# EAGLE design SY88022Al_breakout (EAGLE 9.2.2)
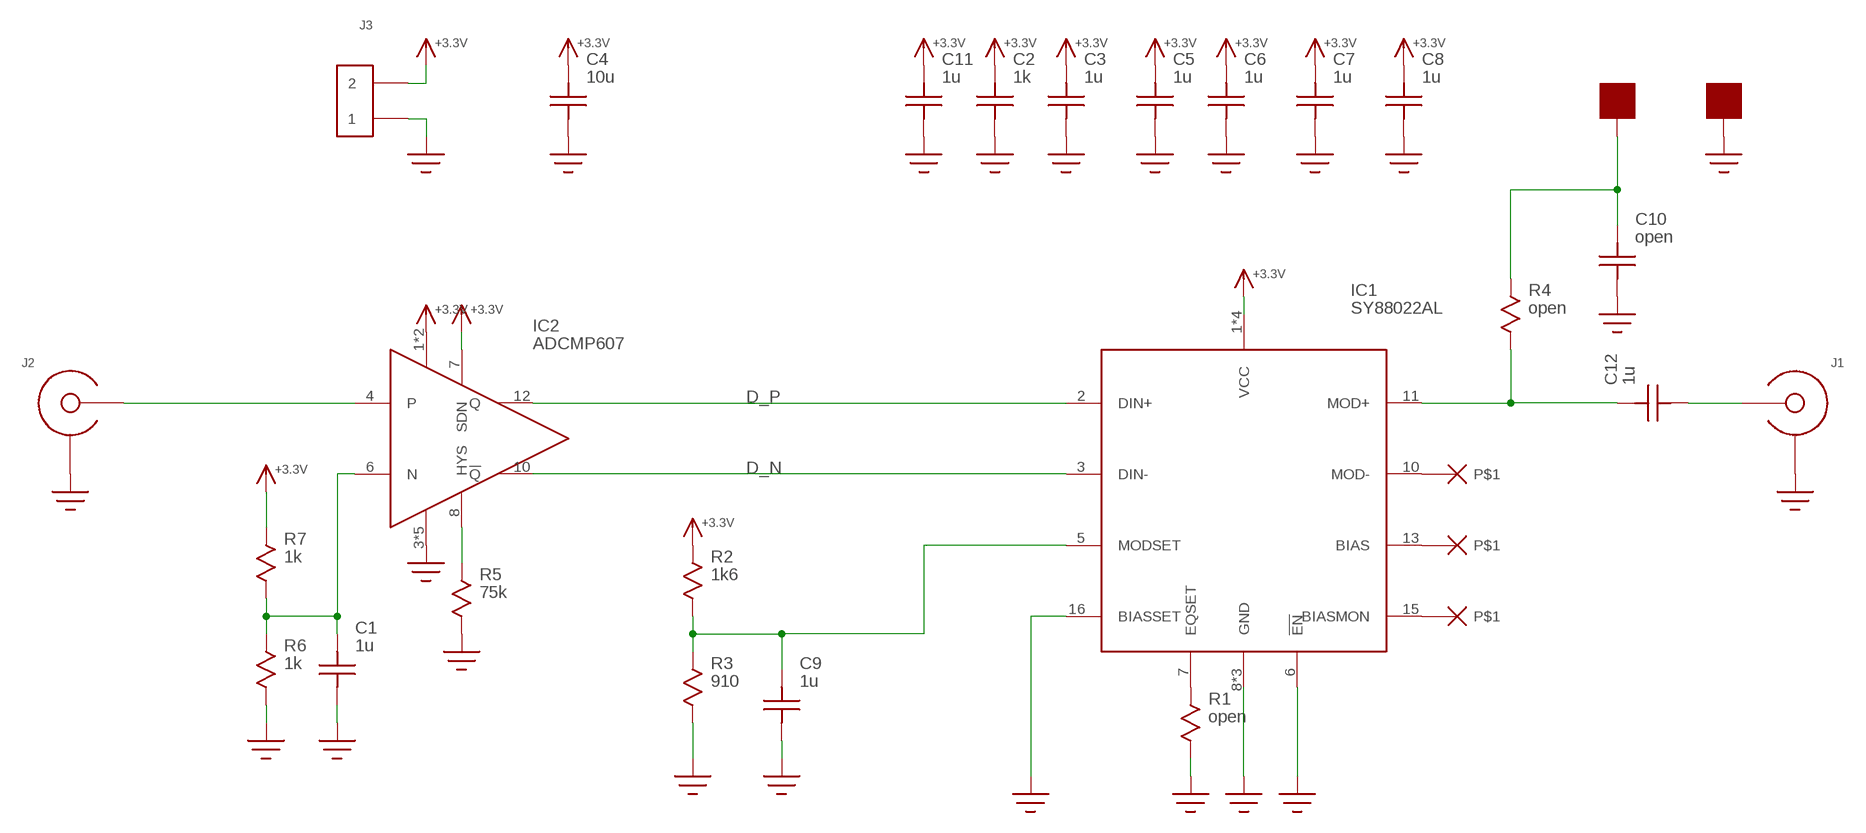
[diagram p0: schematic, sheet 1]

## Parts
C1  1u  C0603  [C0603]
C2  1k  C0603  [C0603]
C3  1u  C0603  [C0603]
C4  10u  C1206  [1206]
C5  1u  C0603  [C0603]
C6  1u  C0603  [C0603]
C7  1u  C0603  [C0603]
C8  1u  C0603  [C0603]
C9  1u  C0603  [C0603]
C10  open  C0603  [C0603]
C11  1u  C0603  [C0603]
C12  1u  C0603  [C0603]
IC1  SY88022AL  [TQFN16-EP]
IC2  ADCMP607  [QFN12-3X3]
J1  EDGE_LAUNCH_JACKNARROW  [EDGE_LAUNCH_RF_CON_NARROW]
J2  EDGE_LAUNCH_JACKNARROW  [EDGE_LAUNCH_RF_CON_NARROW]
J3  HEADER_2PIN  [HEADER_2PIN]
R1  open  R0402  [0402]
R2  1k6  R0603  [R0603]
R3  910  R0603  [R0603]
R4  open  R0603  [R0603]
R5  75k  R0603  [R0603]
R6  1k  R0603  [R0603]
R7  1k  R0603  [R0603]
U$25  NO_CONNECT  (no package)
U$26  NO_CONNECT  (no package)
U$29  PAD100MIL  [PAD_100MIL]
U$36  PAD100MIL  [PAD_100MIL]
U$42  NO_CONNECT  (no package)

## Nets
+3.3V: C2.P$2 C3.P$2 C4.P$2 C5.P$2 C6.P$2 C7.P$2 C8.P$2 C11.P$2 IC1.1(VCC) IC1.4(VCC) IC1.9(VCC) IC1.12(VCC) IC2.1(VCC) IC2.2(VCC) IC2.7(SDN) J3.2 R2.P$1 R7.P$1
D_N [100-ohm-diff]: IC1.3(DIN-) IC2.10(!Q!)
D_P [100-ohm-diff]: IC1.2(DIN+) IC2.12(Q)
GND: C1.P$1 C2.P$1 C3.P$1 C4.P$1 C5.P$1 C6.P$1 C7.P$1 C8.P$1 C9.P$1 C10.P$1 C11.P$1 IC1.6(!EN!) IC1.8(GND) IC1.14(GND) IC1.16(BIASSET) IC1.EP(GND) IC2.3(VEE) IC2.5(VEE) IC2.9(VEE) IC2.11(VEE) IC2.EP(VEE) J1.GND@1(SHIELD) J1.GND@2(SHIELD) J1.GND@3(SHIELD) J1.GND@4(SHIELD) J1.GND@5(SHIELD) J1.GND@6(SHIELD) J1.SHIELD@1(SHIELD) J1.SHIELD@2(SHIELD) J2.GND@1(SHIELD) J2.GND@2(SHIELD) J2.GND@3(SHIELD) J2.GND@4(SHIELD) J2.GND@5(SHIELD) J2.GND@6(SHIELD) J2.SHIELD@1(SHIELD) J2.SHIELD@2(SHIELD) J3.1 R1.2 R3.P$2 R5.P$2 R6.P$2 U$36.P$1
N$1: IC1.7(EQSET) R1.1
N$2: C9.P$2 IC1.5(MODSET) R2.P$2 R3.P$1
N$3: C12.P$1 J1.CENTER
N$4: IC1.13(BIAS) U$25.P$1
N$5: IC1.15(BIASMON) U$26.P$1
N$6: C12.P$2 IC1.11(MOD+) R4.P$2
N$7: C10.P$2 R4.P$1 U$29.P$1
N$8: IC1.10(MOD-) U$42.P$1
N$9: IC2.8(HYS) R5.P$1
N$10: C1.P$2 IC2.6(N) R6.P$1 R7.P$2
N$12: IC2.4(P) J2.CENTER

## Library data of the parts
C1-C12 = yapo:C
IC1 = yapo:SY88022AL
IC2 = yapo:ADCMP607
J1 J2 = yapo:EDGE_LAUNCH_JACK
J3 = yapo:HEADER_2PIN
R1-R7 = yapo:R
U$25 U$26 U$42 = yapo:NO_CONNECT
U$29 U$36 = yapo:PAD

## Net classes
1 100-ohm-diff: width 0.254 mm, clearance 0.254 mm

## Board
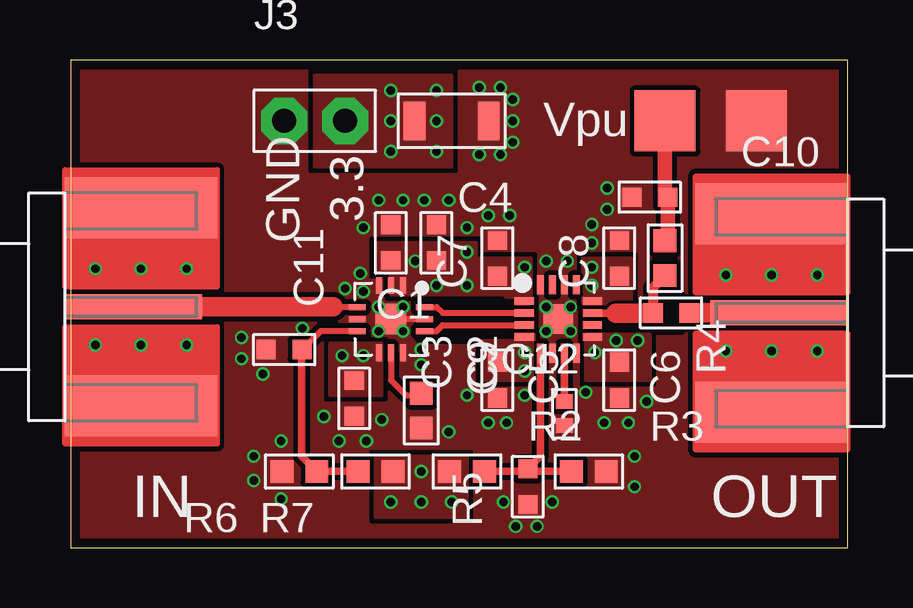
[diagram p1: board, top side]
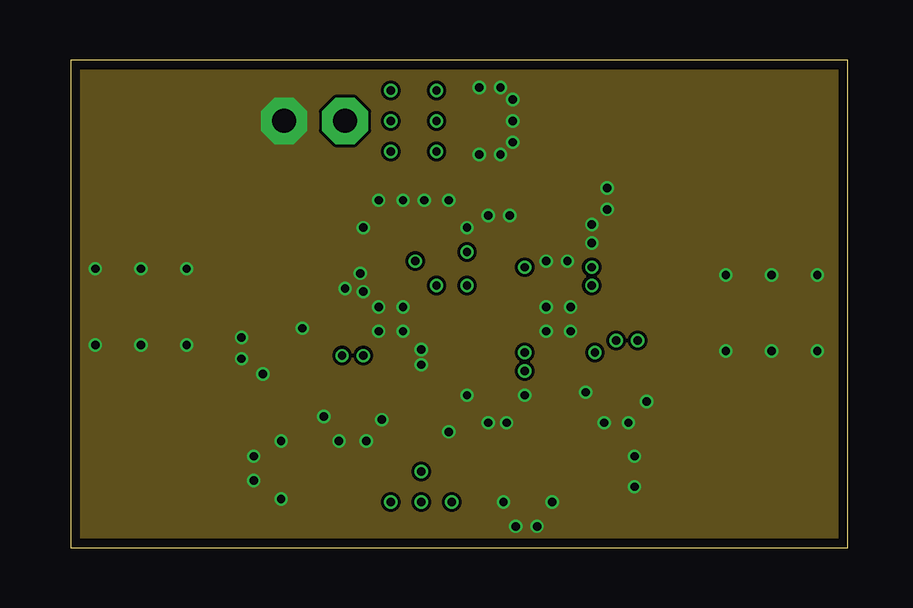
[diagram p2: board, inner layer Route2]
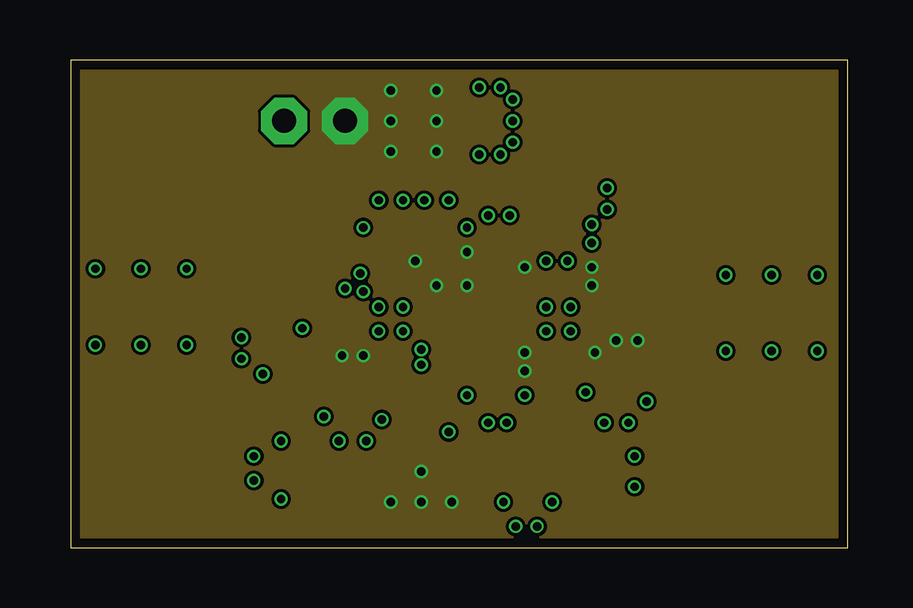
[diagram p3: board, inner layer Route15]
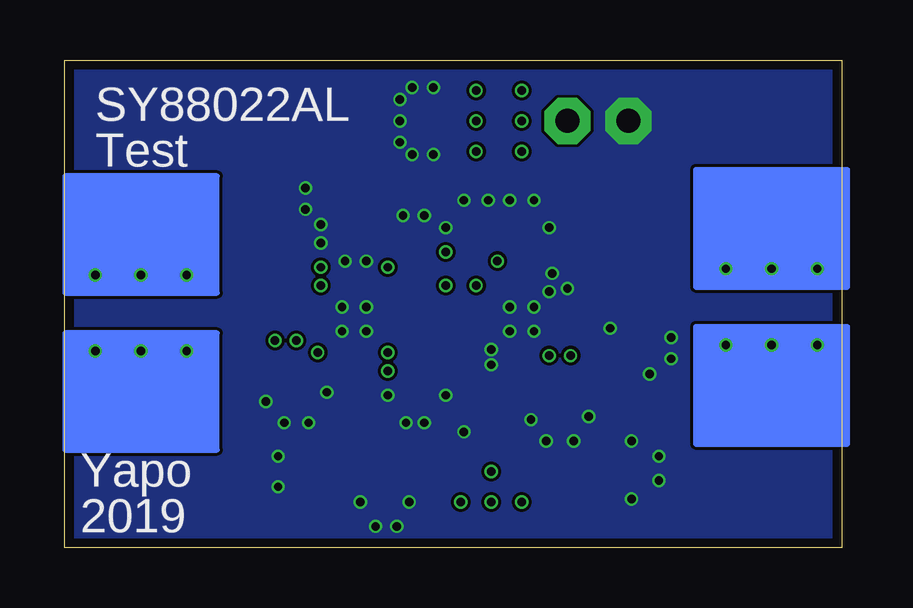
[diagram p4: board, bottom side, seen from below]

Size 32.38 x 20.32 mm. Coordinates in mm from the lower left corner, seen from the top.
Outline: 0,0 32.38,0 32.38,20.32 0,20.32 0,0
Copper layers (1*2*15*16): Top 0.035559375mm / dielectric 0.17018125mm / Route2 0.01778125mm / dielectric 47mil / Route15 0.01778125mm / dielectric 0.17018125mm / Bottom 0.035559375mm
Design rules "oshpark-4layer *": minimum track width 5mil, minimum drill 10mil, track to track 5mil, track to pad 5mil, pad to pad 5mil, via to via 5mil, smd to smd 5mil, copper to edge 15mil, drill to drill 6mil, minimum pad ring 4mil, minimum via ring 4mil, stop-mask expansion 2.5mil, vias tented up to drill 30mil, thermal gap 10mil
tRestrict: area 24.4,9.1 to 25.4,10.4; area 14.6,8.8 to 18.4,10.3

### Footprints (pad centres in the part's own frame; a part is rotated, then mirrored left to right if it is on the bottom)
C0603 = smd 0.8 x 0.8: P$1 -0.75,0; P$2 0.75,0
1206 = smd 0.9 x 1.6: P$1 -1.55,0; P$2 1.55,0
TQFN16-EP = smd 0.3 x 0.8: 1 -0.75,-1.425; 2 -0.25,-1.425; 3 0.25,-1.425; 4 0.75,-1.425; 9 0.75,1.425; 10 0.25,1.425; 11 -0.25,1.425; 12 -0.75,1.425 | smd 0.8 x 0.3: 5 1.425,-0.75; 6 1.425,-0.25; 7 1.425,0.25; 8 1.425,0.75; 13 -1.425,0.75; 14 -1.425,0.25; 15 -1.425,-0.25; 16 -1.425,-0.75 | smd 1.23 x 1.23: EP 0,0
QFN12-3X3 = smd 0.7 x 0.25: 1 -1.4,0.5; 2 -1.4,0; 3 -1.4,-0.5; 7 1.4,-0.5; 8 1.4,0; 9 1.4,0.5 | smd 0.25 x 0.7: 4 -0.5,-1.4; 5 0,-1.4; 6 0.5,-1.4; 10 0.5,1.4; 11 0,1.4; 12 -0.5,1.4 | smd 1.27 x 1.27: EP 0,0
EDGE_LAUNCH_RF_CON_NARROW = smd 5.715 x 1.041: CENTER -2.875,0 | drill 0.35: GND@1 -5.08,1.587; GND@2 -3.175,1.587; GND@3 -1.27,1.587; GND@4 -5.08,-1.587; GND@5 -3.175,-1.587; GND@6 -1.27,-1.587 | smd 6.35 x 2.54: SHIELD@1 -3.175,-4.128; SHIELD@2 -3.175,4.128
HEADER_2PIN = drill 1 pad 1.93 octagon: 1 -1.27,0; 2 1.27,0
0402 = smd 0.6 x 0.7: 1 -0.5,0; 2 0.5,0
R0603 = smd 0.95 x 0.95: P$1 -0.725,0; P$2 0.725,0
PAD_100MIL = smd 2.54 x 2.54: P$1 0,0

### Placement (x,y rotation side)
C1  8.89,8.26 0 top
C2  15.24,12.7 270 top
C3  13.34,12.7 270 top
C4  15.88,17.78 180 top
C5  17.78,12.06 270 top
C6  22.86,12.06 270 top
C7  17.78,6.99 90 top
C8  22.86,6.99 90 top
C9  19.05,2.54 90 top
C10  24.13,14.61 0 top
C11  11.81,6.22 90 top
C12  25.02,9.78 180 top
IC1  20.32,9.53 270 top
IC2  13.34,9.53 270 top
J1  32.38,9.78 0 top
J2  -0.25,10.03 180 top
J3  10.16,17.78 0 top
R1  20.57,5.59 270 top
R2  16.51,3.17 0 top
R3  21.59,3.17 0 top
R4  24.77,12.06 270 top
R5  14.61,5.71 270 top
R6  9.53,3.17 180 top
R7  12.7,3.17 180 top
U$29  24.77,17.78 0 top
U$36  28.57,17.78 0 top

### Tracks (layer width: path | path; a pad name or v marks a point on that pad's centre or on a via)
+3.3V  (via drill 0.35)
  other vias: 16.51,10.92 22.73,8.64 21.72,11.68 18.92,7.37 13.34,1.91 14.61,1.91 15.88,1.91 12.19,8 15.24,19.05 15.24,17.78 15.24,16.51 13.34,19.05 13.34,17.78 13.34,16.51 16.51,12.32 18.92,11.68 15.24,10.92 18.92,8.13 21.72,10.92 21.84,8.13 14.35,11.94 11.3,8 23.62,8.64 14.61,3.17
  pour Top (no thermals): 12.7,12.7 16.89,12.7 16.89,12.06 19.18,12.06 19.18,10.16 18.41,10.16 18.03,10.54 13.34,10.54 13.34,11.43 12.7,11.43
  pour Top (no thermals): 21.34,10.16 21.34,12.06 23.37,12.06 23.37,10.16
  pour Top (no thermals): 17.14,6.99 19.3,6.99 19.3,8.89 17.14,8.89
  pour Top (no thermals): 21.46,8.89 21.46,6.99 24.13,6.99 24.13,8.89
  pour Top (no thermals): 12.7,3.81 16.51,3.81 16.51,1.27 12.7,1.27
  pour Route15 (no thermals): 0,0 32.38,0 32.38,20.32 0,20.32
  pour Top (no thermals): 10.79,6.35 12.95,6.35 12.95,8.51 10.79,8.51
  pour Top (no thermals): 10.16,19.68 10.16,15.88 15.88,15.88 15.88,19.68
D_N
  Top 0.254: IC2.10 15.25,9.03 15.49,9.27 IC1.3
D_P
  Top 0.254: IC2.12 15.25,10.03 15.49,9.78 IC1.2
GND  (via drill 0.35)
  Top 0.254: IC2.11 13.97,9.53 13.84,9.4 v13.84,9.02
  other vias: 12.19,10.67 11.43,10.79 9.65,9.14 14.61,8.26 14.61,7.62 19.81,11.94 20.7,11.94 21.46,6.48 8,7.24 7.11,8.76 7.11,7.87 12.83,14.48 13.84,14.48 14.73,14.48 15.75,14.48 17.4,13.84 18.29,13.84 22.35,14.1 22.35,14.99 21.72,12.7 21.72,13.46 12.19,13.34 16.51,13.34 24,6.1 23.24,5.21 22.23,5.21 23.5,3.81 23.5,2.54 20.07,1.91 18.03,1.91 19.43,0.89 8.76,2.03 7.62,2.79 7.62,3.81 8.76,4.45 18.54,0.89 12.32,4.45 11.18,4.45 10.54,5.46 15.75,4.83 12.95,5.33 16.51,6.35 17.4,5.21 18.16,5.21 18.92,6.35 17.02,16.38 17.91,16.38 17.02,19.18 17.91,19.18 18.41,18.67 18.41,17.78 18.41,16.89 12.06,11.43 12.83,9.02 12.83,10.03 13.84,10.03 19.81,10.03 19.81,9.02 20.83,9.02 20.83,10.03
  pour Top (isolate 0.203, rank 2, no thermals): 0,0 32.38,0 32.38,20.32 0,20.32
  pour Route2 (no thermals): 0,0 32.38,0 32.38,20.32 0,20.32
  pour Bottom (no thermals): 0,0 32.38,0 32.38,20.32 0,20.32
N$1
  Top 0.305: IC1.7 R1.1
N$2
  Top 0.305: R3.P$1 19.16,3.17 | 19.16,3.17 C9.P$2 19.57,3.81 IC1.5 | R2.P$2 19.16,3.17
N$3
  Top 0.813: C12.P$1 J1.CENTER
N$6
  Top 0.305: IC1.11 22.73,9.78 arc90 22.73,9.78
  Top 0.406: R4.P$2 24.27,10.84 C12.P$2
  Top 0.813: 22.73,9.78 C12.P$2
N$7
  Top 0.61: U$29.P$1 24.77,14.72 C10.P$2 24.88,12.9 R4.P$1
N$9
  Top 0.254: IC2.8 13.34,6.99 13.97,6.35 14.52,6.35 R5.P$1
N$10
  Top 0.254: IC2.6 10.41,9.03 C1.P$2
  Top 0.305: R7.P$2 R6.P$1 9.62,3.81 9.62,8.23 C1.P$2
N$12
  Top 0.254: IC2.4 10.17,10.03 arc-90 10.16,10.03
  Top 0.813: J2.CENTER 10.16,10.03 10.92,10.03

### Text on the board
tPlace: Vpu | 3.3 | GND | IN | OUT
bPlace: SY88022AL | Test | Yapo | 2019